# Altium project SLBMM.PrjPcb
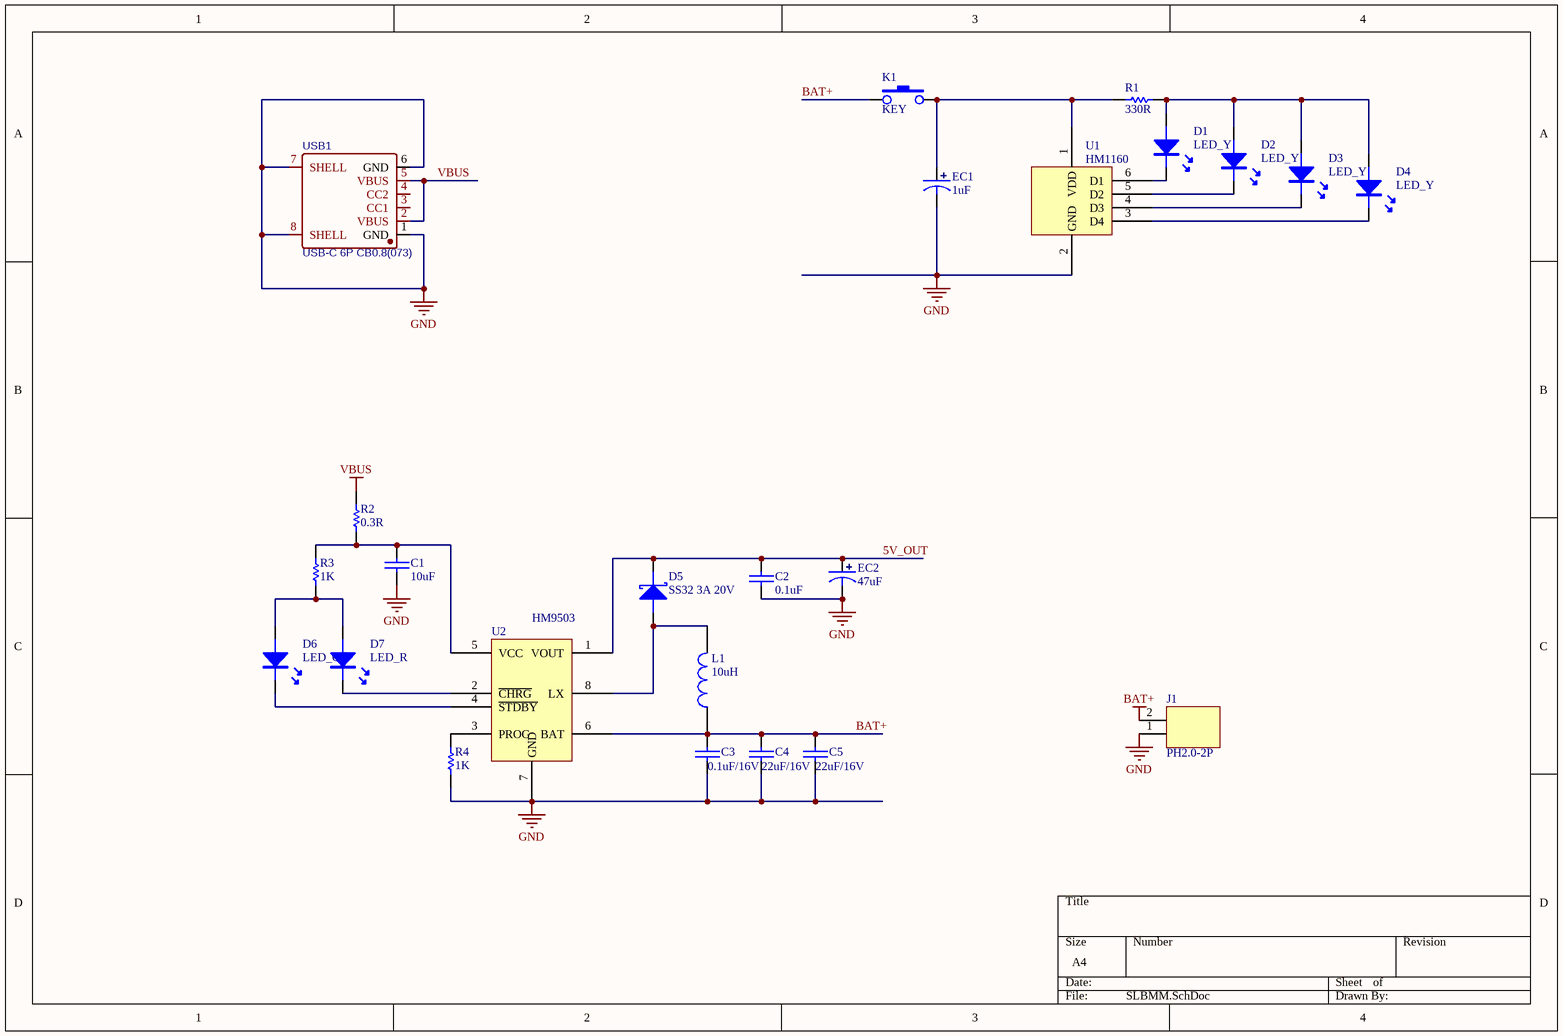
[diagram p0: SLBMM.SchDoc]
1 sheet, 24 parts. Net scope: global (net labels, ports and power ports of the same name join across sheets).
Board file: SLBMM.PcbDoc

## Sheet SLBMM.SchDoc
size A4; SheetNumber: 1; SheetTotal: 1

### Parts
C1  10uF  [0603C]
C2  0.1uF  [0603C]
C3  0.1uF/16V  [0603C]
C4  22uF/16V  [0603C]
C5  22uF/16V  [0603C]
D1  LED_Y  [LED-0603Y]
D2  LED_Y  [LED-0603Y]
D3  LED_Y  [LED-0603Y]
D4  LED_Y  [LED-0603Y]
D5  SS32 3A 20V  [SMA/DO-214AC]
D6  LED_G  [LED-0603G]
D7  LED_R  [LED-0603B]
EC1  1uF  [SMD-EC4.0X4.3X5.4]
EC2  47uF  [SMD-EC4.0X4.3X5.4]
J1  PH2.0-2P  [PH2.0-2P]
K1  KEY  [SMD-3.5x7.8x2.5_C]
L1  10uH  [0630L]
R1  330R  [0603R]
R2  0.3R  [0603R]
R3  1K  [0603R]
R4  1K  [0603R]
U1  HM1160  [SOT23-6]
U2  HM9503  [ESOP8]
USB1  USB-C 6P CB0.8(073)  [USB-C-SMD_TYPE-C-6P-CB0.8-073]

### Nets
BAT+: C3.2 C4.2 C5.2 J1.2 K1.1 L1.1 U2.6(BAT)
GND: C1.1 C2.1 C3.1 C4.1 C5.1 EC1.2 EC2.2 J1.1 R4.1 U1.2(GND) U2.7(GND) USB1.1(GND) USB1.6(GND) USB1.7(SHELL) USB1.8(SHELL)
VBUS: R2.2 USB1.2(VBUS) USB1.5(VBUS)
5V_OUT: C2.2 D5.K EC2.1 U2.1(VOUT)
NetC1_2: C1.2 R2.1 R3.2 U2.5(VCC)
NetD1_A: D1.A D2.A D3.A D4.A R1.1
NetD1_K: D1.K U1.6(D1)
NetD2_K: D2.K U1.5(D2)
NetD3_K: D3.K U1.4(D3)
NetD4_K: D4.K U1.3(D4)
NetD5_A: D5.A L1.2 U2.8(LX)
NetD6_A: D6.A D7.A R3.1
NetD6_K: D6.K U2.4(~{STDBY})
NetD7_K: D7.K U2.2(~{CHRG})
NetEC1_1: EC1.1 K1.3 R1.2 U1.1(VDD)
NetR4_2: R4.2 U2.3(PROG)

Not connected (* = marked no-connect by the designer): USB1 3(CC1) 4(CC2)

### Library data of the parts
C1-C5 = CAP: 无极性电容
D1-D4 D6 D7 = LED
D5 = DIODE SCHOTTKY: 肖特基二极管
EC1 EC2 = SMD_ECAP: 贴片电解电容
K1 = KEY: pin to pad: 1>3 3>4
L1 = INDUCTOR
R1-R4 = RES
U1 = HM1160: 单节锂电池电量指示芯片
U2 = HM9503: 1A锂电池充电和5V/1A升压控制 / 芯片
USB1 = USB-C 6P CB0.8(073): BOM_Manufacturer: SHOU HAN(首韩); BOM_Manufacturer Part: TYPE-C 6P CB0.8(073); Contributor: LCSC; BOM_Supplier: LCSC; BOM_Supplier Part: C2858273; spicePre: U; spiceSymbolName: TYPE-C 6P CB0.8(073)